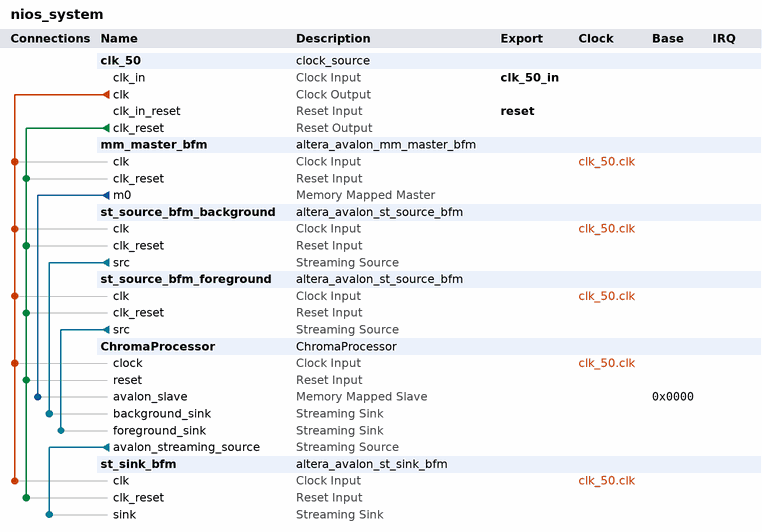
[diagram p0: system contents]
# Platform Designer (Qsys) system nios_system, Cyclone IV E EP4CE115F29C7
# Parameters at their usual value, and those the tool derives, are not listed.
package require -exact qsys 17.1
create_system nios_system
set_project_property DEVICE_FAMILY {Cyclone IV E}
set_project_property DEVICE EP4CE115F29C7

add_instance clk_50 clock_source 17.1
set_instance_parameter_value clk_50 clockFrequency 50000000

add_instance mm_master_bfm altera_avalon_mm_master_bfm 17.1
set_instance_parameter_value mm_master_bfm ADDRESS_UNITS WORDS
set_instance_parameter_value mm_master_bfm AV_ADDRESS_W 3
set_instance_parameter_value mm_master_bfm AV_ALWAYS_BURST_MAX_BURST 0
set_instance_parameter_value mm_master_bfm AV_BURSTCOUNT_W 1
set_instance_parameter_value mm_master_bfm AV_BURST_BNDR_ONLY 0
set_instance_parameter_value mm_master_bfm AV_BURST_LINEWRAP 0
set_instance_parameter_value mm_master_bfm AV_CONSTANT_BURST_BEHAVIOR 0
set_instance_parameter_value mm_master_bfm AV_FIX_READ_LATENCY 0
set_instance_parameter_value mm_master_bfm AV_MAX_PENDING_WRITES 0
set_instance_parameter_value mm_master_bfm AV_NUMSYMBOLS 4
set_instance_parameter_value mm_master_bfm AV_READRESPONSE_W 8
set_instance_parameter_value mm_master_bfm AV_READ_WAIT_TIME 1
set_instance_parameter_value mm_master_bfm AV_WRITERESPONSE_W 8
set_instance_parameter_value mm_master_bfm USE_BURSTCOUNT 0
set_instance_parameter_value mm_master_bfm USE_BYTE_ENABLE 0
set_instance_parameter_value mm_master_bfm USE_READ 1
set_instance_parameter_value mm_master_bfm USE_READ_DATA 1
set_instance_parameter_value mm_master_bfm USE_READ_DATA_VALID 0
set_instance_parameter_value mm_master_bfm USE_WAIT_REQUEST 1
set_instance_parameter_value mm_master_bfm VHDL_ID 0

add_instance st_source_bfm_background altera_avalon_st_source_bfm 17.1
set_instance_parameter_value st_source_bfm_background ST_CHANNEL_W 1
set_instance_parameter_value st_source_bfm_background ST_ERROR_W 1
set_instance_parameter_value st_source_bfm_background ST_MAX_CHANNELS 1
set_instance_parameter_value st_source_bfm_background ST_NUMSYMBOLS 3
set_instance_parameter_value st_source_bfm_background ST_SYMBOL_W 10
set_instance_parameter_value st_source_bfm_background USE_CHANNEL 0
set_instance_parameter_value st_source_bfm_background USE_EMPTY 0
set_instance_parameter_value st_source_bfm_background USE_ERROR 0
set_instance_parameter_value st_source_bfm_background USE_PACKET 1
set_instance_parameter_value st_source_bfm_background USE_READY 1
set_instance_parameter_value st_source_bfm_background USE_VALID 1

add_instance st_source_bfm_foreground altera_avalon_st_source_bfm 17.1
set_instance_parameter_value st_source_bfm_foreground ST_CHANNEL_W 1
set_instance_parameter_value st_source_bfm_foreground ST_ERROR_W 1
set_instance_parameter_value st_source_bfm_foreground ST_MAX_CHANNELS 1
set_instance_parameter_value st_source_bfm_foreground ST_NUMSYMBOLS 3
set_instance_parameter_value st_source_bfm_foreground ST_SYMBOL_W 10
set_instance_parameter_value st_source_bfm_foreground USE_CHANNEL 0
set_instance_parameter_value st_source_bfm_foreground USE_EMPTY 0
set_instance_parameter_value st_source_bfm_foreground USE_ERROR 0
set_instance_parameter_value st_source_bfm_foreground USE_PACKET 1
set_instance_parameter_value st_source_bfm_foreground USE_READY 1
set_instance_parameter_value st_source_bfm_foreground USE_VALID 1

add_instance ChromaProcessor ChromaProcessor 1.0

add_instance st_sink_bfm altera_avalon_st_sink_bfm 17.1
set_instance_parameter_value st_sink_bfm ST_CHANNEL_W 1
set_instance_parameter_value st_sink_bfm ST_ERROR_W 1
set_instance_parameter_value st_sink_bfm ST_MAX_CHANNELS 1
set_instance_parameter_value st_sink_bfm ST_NUMSYMBOLS 3
set_instance_parameter_value st_sink_bfm ST_READY_LATENCY 0
set_instance_parameter_value st_sink_bfm ST_SYMBOL_W 10
set_instance_parameter_value st_sink_bfm USE_CHANNEL 0
set_instance_parameter_value st_sink_bfm USE_EMPTY 0
set_instance_parameter_value st_sink_bfm USE_ERROR 0
set_instance_parameter_value st_sink_bfm USE_PACKET 1
set_instance_parameter_value st_sink_bfm USE_READY 1
set_instance_parameter_value st_sink_bfm USE_VALID 1
set_instance_parameter_value st_sink_bfm VHDL_ID 0

# connections
add_connection clk_50.clk ChromaProcessor.clock clock
add_connection clk_50.clk mm_master_bfm.clk clock
add_connection clk_50.clk st_sink_bfm.clk clock
add_connection clk_50.clk st_source_bfm_background.clk clock
add_connection clk_50.clk st_source_bfm_foreground.clk clock
add_connection clk_50.clk_reset ChromaProcessor.reset reset
add_connection clk_50.clk_reset mm_master_bfm.clk_reset reset
add_connection clk_50.clk_reset st_sink_bfm.clk_reset reset
add_connection clk_50.clk_reset st_source_bfm_background.clk_reset reset
add_connection clk_50.clk_reset st_source_bfm_foreground.clk_reset reset
add_connection mm_master_bfm.m0 ChromaProcessor.avalon_slave avalon
set_connection_parameter_value mm_master_bfm.m0/ChromaProcessor.avalon_slave baseAddress 0x0000
add_connection ChromaProcessor.avalon_streaming_source st_sink_bfm.sink avalon_streaming
add_connection st_source_bfm_background.src ChromaProcessor.background_sink avalon_streaming
add_connection st_source_bfm_foreground.src ChromaProcessor.foreground_sink avalon_streaming

# exported interfaces
add_interface clk_50_in clock sink
set_interface_property clk_50_in EXPORT_OF clk_50.clk_in
add_interface reset reset sink
set_interface_property reset EXPORT_OF clk_50.clk_in_reset

set_interconnect_requirement {$system} qsys_mm.clockCrossingAdapter HANDSHAKE
set_interconnect_requirement {$system} qsys_mm.enableEccProtection FALSE
set_interconnect_requirement {$system} qsys_mm.insertDefaultSlave FALSE
set_interconnect_requirement {$system} qsys_mm.maxAdditionalLatency 1

save_system nios_system.qsys
